# EasyEDA schematic 1-Schematic_ReflowPlate.json
TITLE: Sheet_1; REV: 1.0; Date: 2022-12-13; Sheet: 1/1; Drawn By: Myron Rodrigues; Company: Your Company
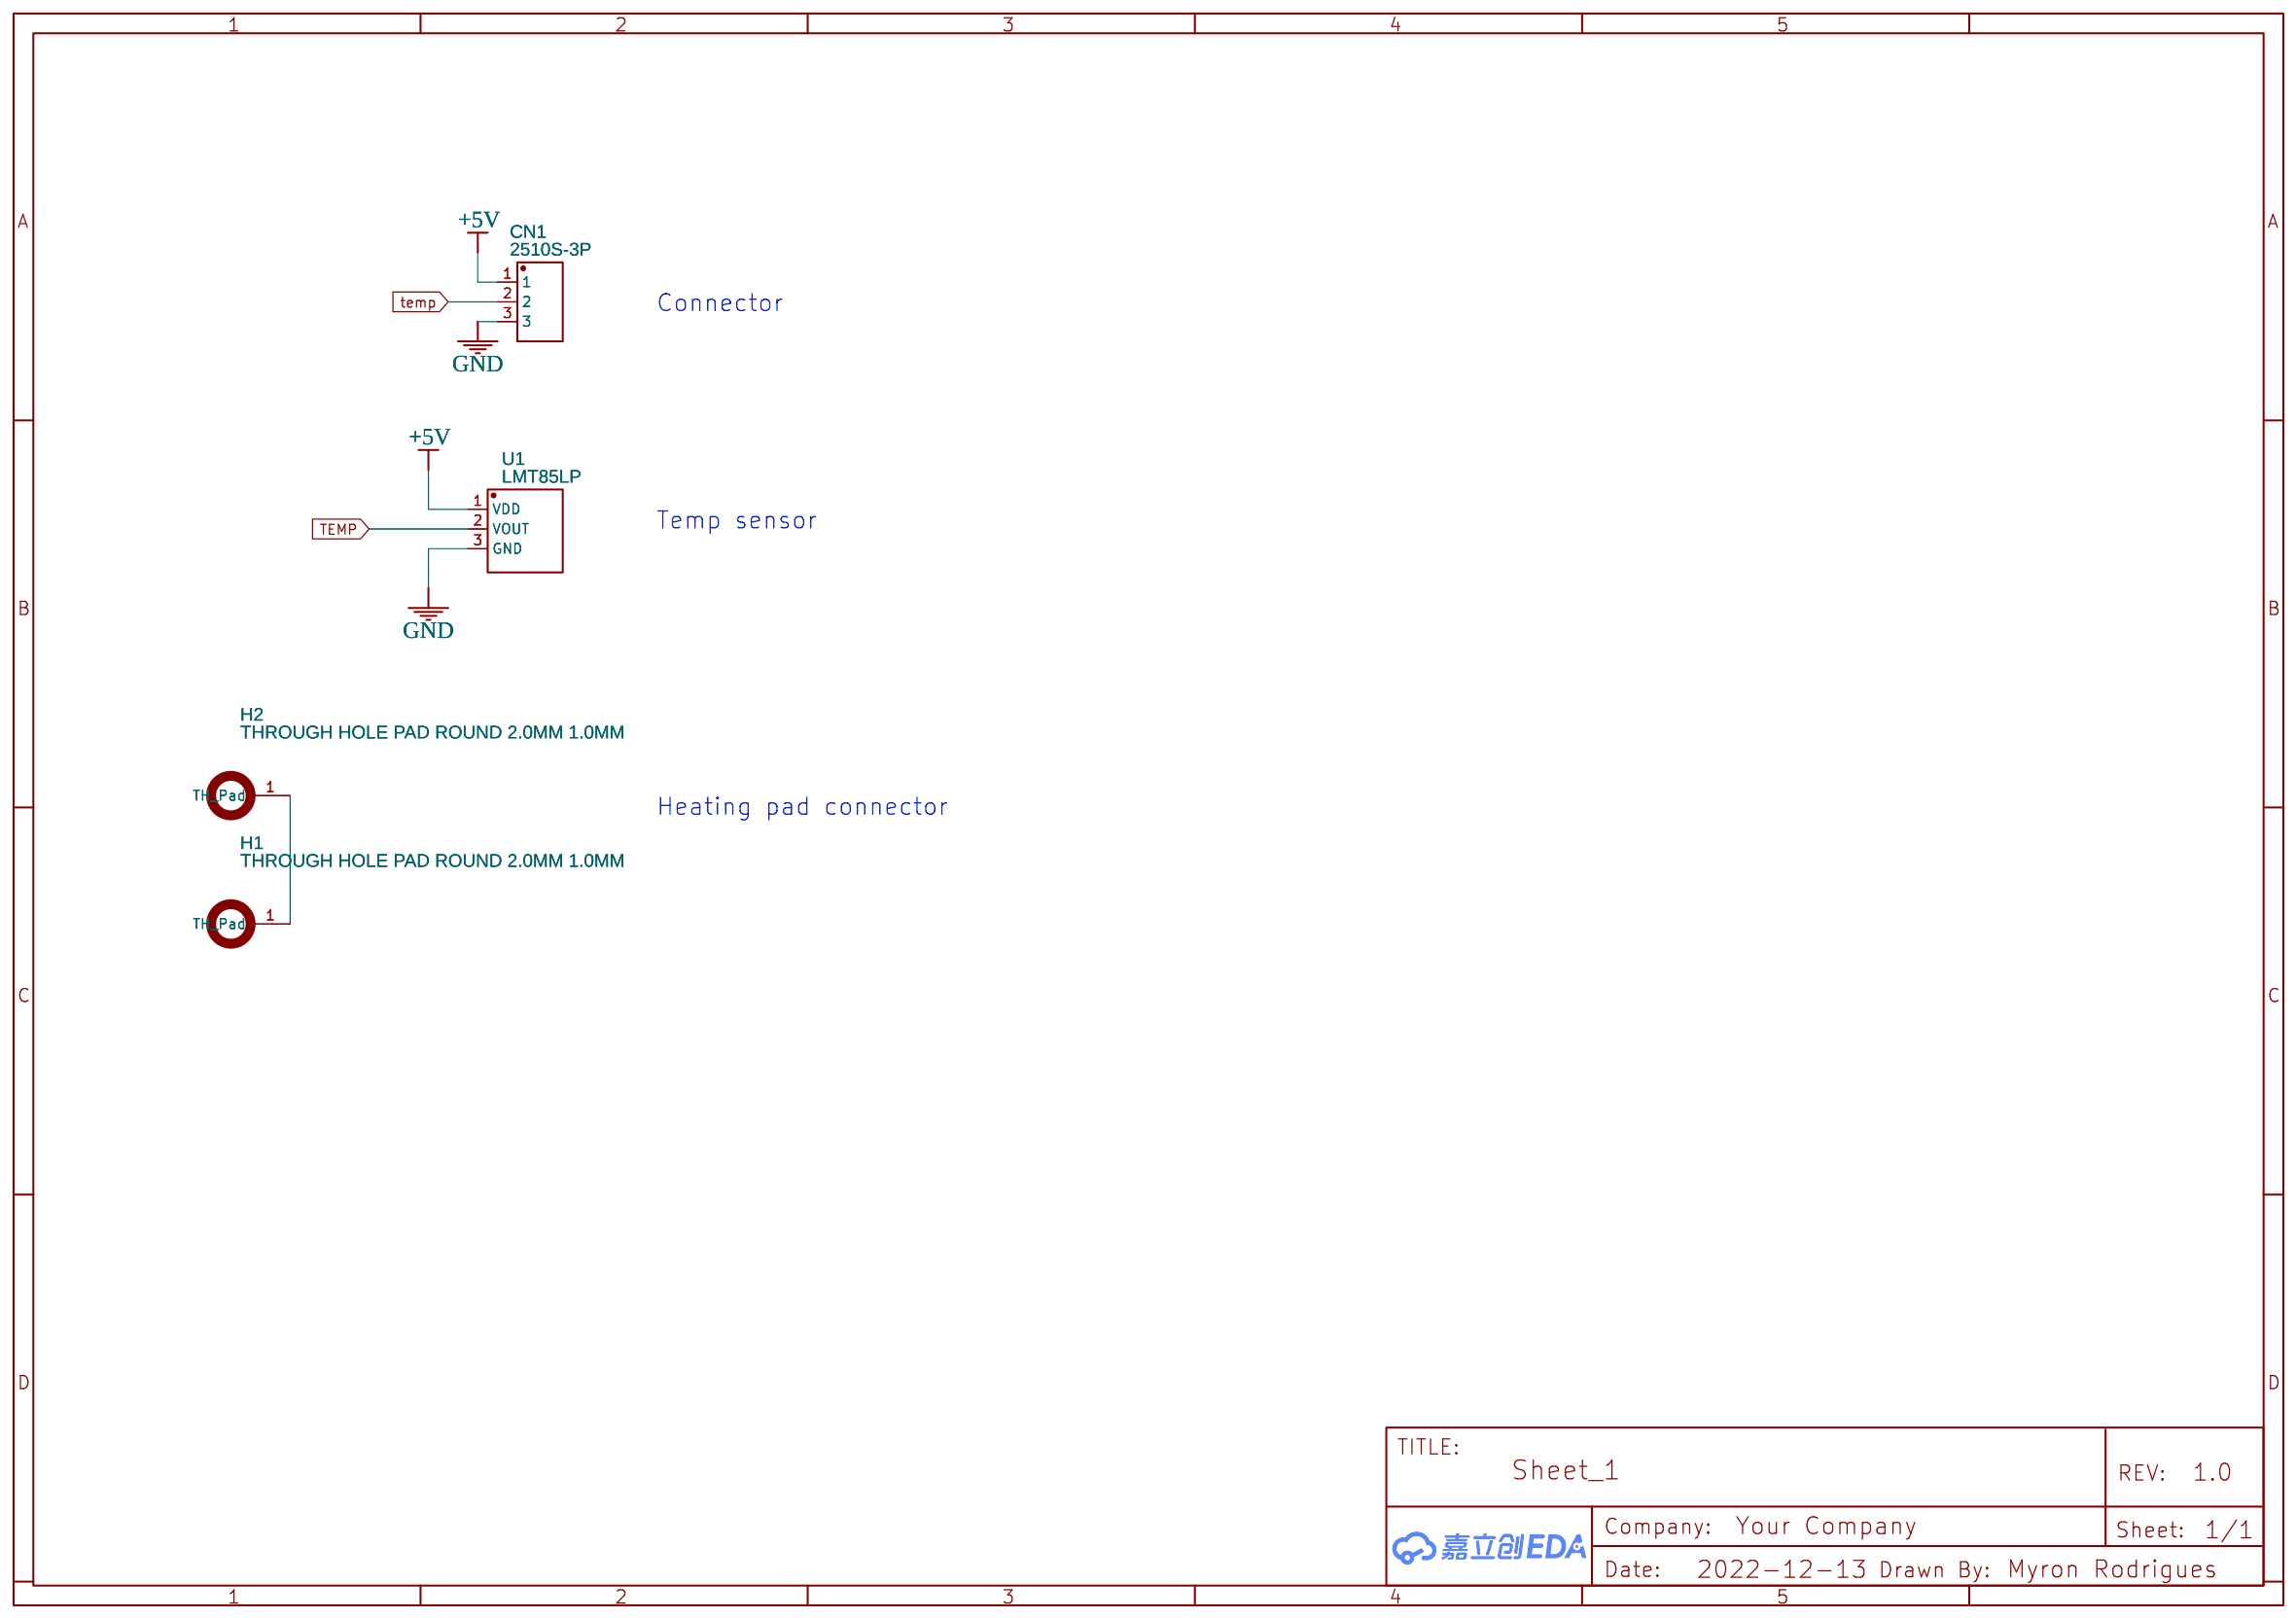
[diagram p0: schematic sheet]

## Parts
CN1  2510S-3P  [CONN-TH_2510S-3P]
H1  THROUGH HOLE PAD ROUND 2.0MM 1.0MM  [THROUGH HOLE PAD 1.7MM HOLE 3.0MM PAD]
H2  THROUGH HOLE PAD ROUND 2.0MM 1.0MM  [THROUGH HOLE PAD 1.7MM HOLE 3.0MM PAD]
U1  LMT85LP  [TO-92-3_L4.9-W3.7-P1.27-L]

## Library data of the parts
CN1 = 2510S-3P: Supplier: LCSC; Manufacturer: Ckmtw(灿科盟); Manufacturer Part: W-2510S03P-0000; Contributor: LCSC; Supplier Part: C132505; JLCPCB Part Class: Extended Part
H1 H2 = THROUGH HOLE PAD ROUND 2.0MM 1.0MM: Contributor: Nuutti Siltala
U1 = LMT85LP: Supplier: LCSC; Manufacturer: TI(德州仪器); Contributor: LCSC; Supplier Part: C75856; JLCPCB Part Class: Extended Part

## Nets
+5V: CN1.1 U1.1(VDD)
GND: CN1.3 U1.3(GND)
TEMP: U1.2(VOUT)
temp: CN1.2
Net-(H1-1): H1.1(TH Pad) H2.1(TH Pad)

## Notes on the sheet
- Connector
- Temp sensor
- Heating pad connector
